# Altium schematic sheet BME280.SchDoc: STM32 LoRa Node
size A4; Author: Leon Baždar; CompanyName: FER; Address1: Zagreb; Revision: V1.0; SheetNumber: 4; SheetTotal: 6
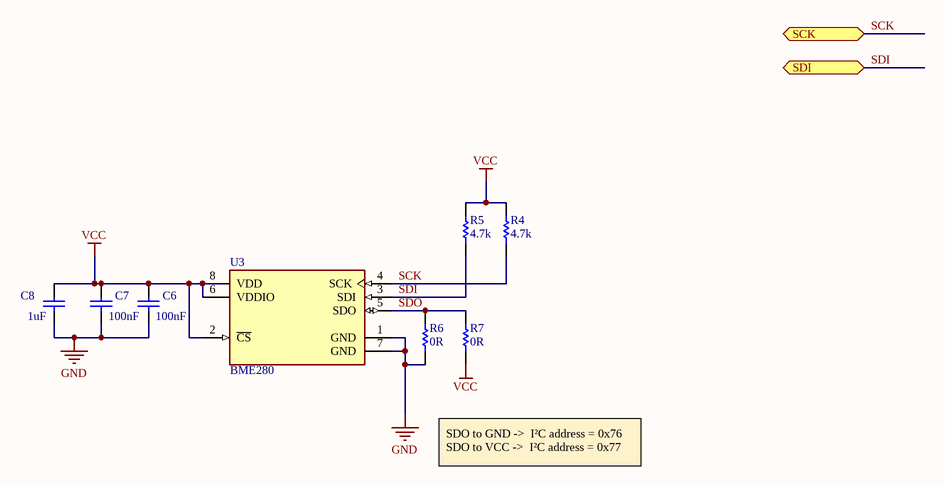
[diagram p0: BME280.SchDoc]

## Parts
C6  100nF  [CAPC1005X56X25LL10T15]
C7  100nF  [CAPC1005X56X25LL10T15]
C8  1uF  [CAPC2013X145X50LL20T25]
R4  4.7k  [RESC1005X40X25LL05T05]
R5  4.7k  [RESC1005X40X25LL05T05]
R6  0R  [RESC1005X40X25ML05T10]
R7  0R  [RESC1005X40X25ML05T10]
U3  BME280  [FP-BME280-MFG]

## Ports
SCK (bidir), SDI (bidir)

## Nets
GND: C6.2 C7.2 C8.2 R6.1 U3.1(GND) U3.7(GND)
VCC: C6.1 C7.1 C8.1 R4.2 R5.2 R7.1 U3.2(~{CS}) U3.6(VDDIO) U3.8(VDD)
SCK: R4.1 U3.4(SCK) ; port SCK
SDI: R5.1 U3.3(SDI) ; port SDI
SDO: R6.2 R7.2 U3.5(SDO)

## Notes on the sheet
- SDO to GND ->  I²C address = 0x76
  SDO to VCC ->  I²C address = 0x77
- Project:
- File:
- Size:
- A4
- Author:
- Revision:
- Date:
- Sheet
- of

## Library data of the parts
C6 C7 = CMP-2008-02842-1: Part Number: 0402YD104KAT2A; Manufacturer: AVX Interconnect / Elco
C8 = CMP-2007-01016-1: Manufacturer: Kemet; Part Number: C0805C105K4PACTU
R4 R5 = CMP-1665-00031-3: Chip Resistor, 4.7 KOhm, +/- 1%, 0.1 W, -55 to 155 degC, 0402 (1005 Metric), RoHS, Tape and Reel; PartNumber: ERJ-2RKF4701X; Voltage Rating: 50 V; Case\/Package: 0402; Power Rating: 100 mW; Height: 0.35 mm; Mounting Technology: Surface Mount; REACH SVHC: Yes; Resistance: 4.7 KOhm; Max Operating Temperature: 155 degC; ComponentLink1Description: Manufacturer URL; ComponentLink2Description: Datasheet; Pins: 2; PackageReference: 0402; Tolerance: 1%; Case Code (Imperial): 0402; Length: 1 mm; PackageDescription: 2-Pin Surface Mount Device, Body 1 x 0.5 mm; RoHSCompliant: true; Package Quantity: 1; Radiation Hardening: No; DatasheetVersion: 04/2015; Width: 0.5 mm; Case Code (Metric): 1005; Mount: Surface Mount; ComponentLink1URL: http://www.panasonic.com/; Min Operating Temperature: -55 degC; Packaging: Cut Tape; ComponentLink2URL: http://industrial.panasonic.com/cdbs/www-data/pdf/RDA0000/AOA0000C86.pdf
R6 R7 = CMP-2002-08060-1: Manufacturer: Yageo / Phycomp; Part Number: RC0402JR-130RL
U3 = CMP-191074-000001-1: SENSOR PRESSURE HUMIDITY TEMP; Output Type: SPI; Sensor Type: Temperature; Response Time: 1s; Accuracy: 3%; Packaging: Cut Tape; Lead Free: Lead Free; Number of Pins: 8; Min Operating Temperature: -40°C; Max Operating Temperature: 85°C; Mount: Surface Mount; Case/Package: LGA